# Altium schematic sheet [1] Shield.SchDoc
size A4; DocumentNumber: 2; SheetNumber: 2; SheetTotal: 5
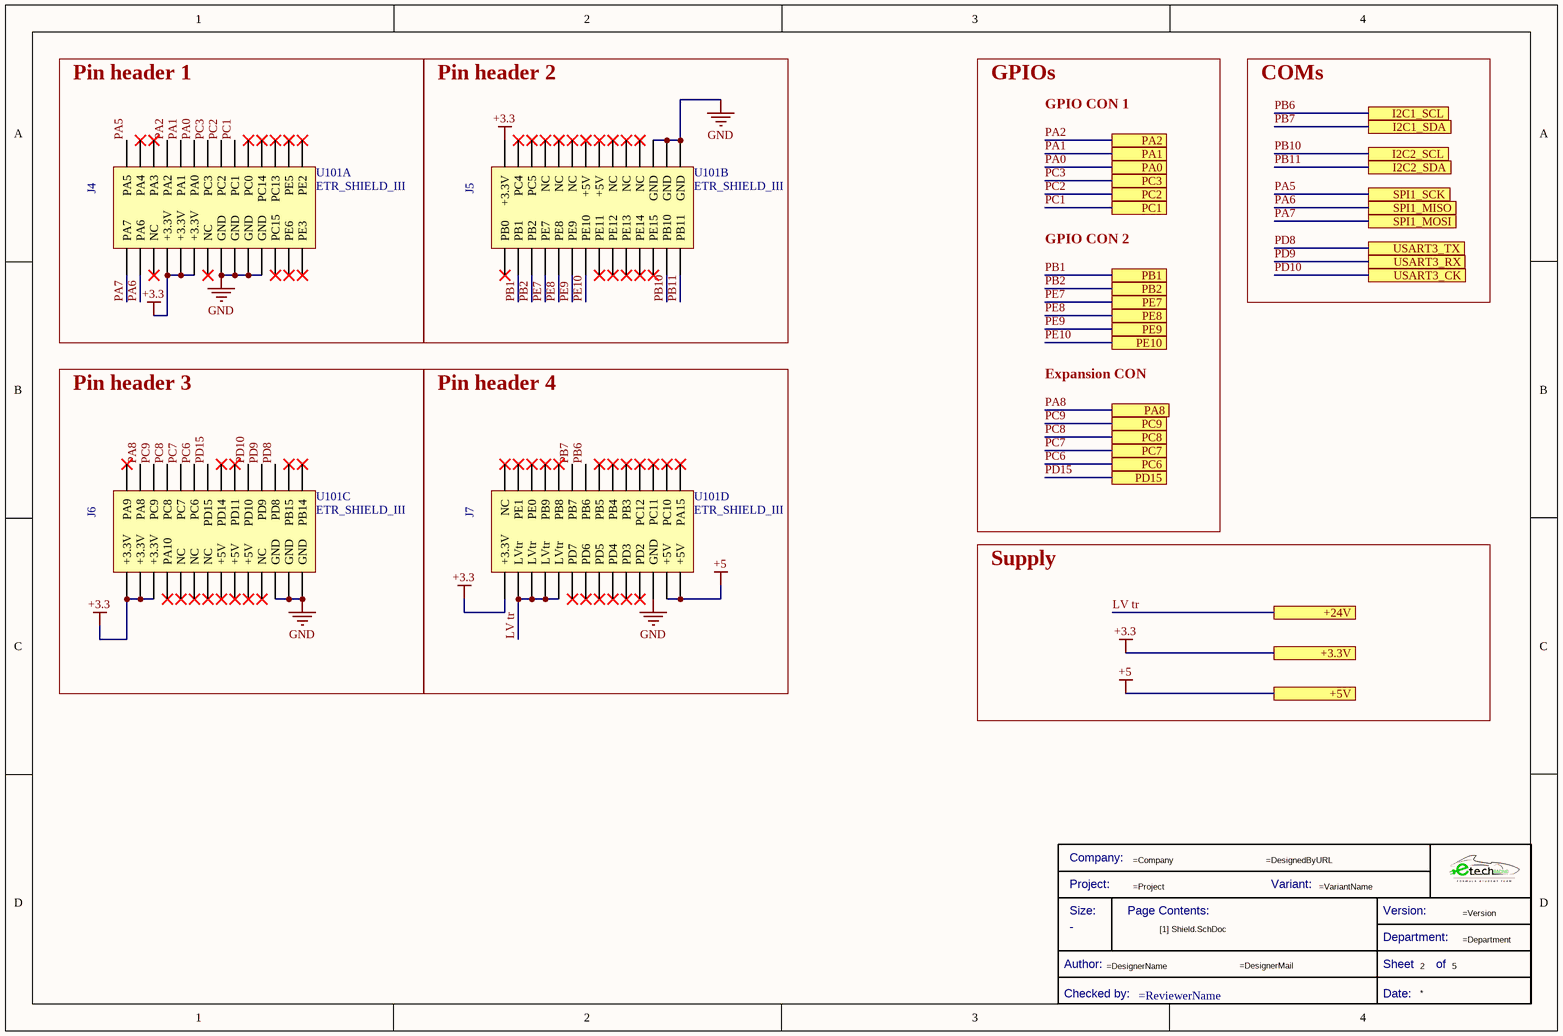
[diagram p0: [1] Shield.SchDoc]

## Parts
*  Title Block_template  (value not drawn)  (graphical)
U101  ETR_SHIELD_III  [ETR_SHIELD_III]  (parts A,B,C,D of 4)

## Blocks framed on the sheet
Pin header 1: U101
Pin header 2: U101
Pin header 3: U101
Pin header 4: U101

## Ports
+3.3V (see ETRX_FECU[2A]), +5V (see ETRX_FECU[2A]), +24V (see ETRX_FECU[2A]), I2C1_SCL (see ETRX_FECU[1A]), I2C1_SDA (see ETRX_FECU[1A]), I2C2_SCL (see ETRX_FECU[1A]), I2C2_SDA (see ETRX_FECU[1A]), PA0 (see ETRX_FECU[2A], [2] Sensors[1A]), PA1 (see ETRX_FECU[2A], [2] Sensors[1A]), PA2 (see ETRX_FECU[2A], [2] Sensors[1A]), PA8 (see ETRX_FECU[1B]), PB1 (see ETRX_FECU[2B], [2] Sensors[1A]), PB2 (see ETRX_FECU[2B], [2] Sensors[1A]), PC1 (see ETRX_FECU[2B], [2] Sensors[1A]), PC2 (see ETRX_FECU[2A], [2] Sensors[1A]), PC3 (see ETRX_FECU[2A], [2] Sensors[1A]), PC6 (see ETRX_FECU[1B]), PC7 (see ETRX_FECU[1B]), PC8 (see ETRX_FECU[1B]), PC9 (see ETRX_FECU[1B]), PD15 (see ETRX_FECU[1B]), PE7 (see ETRX_FECU[2B], [2] Sensors[1A]), PE8 (see ETRX_FECU[2B], [2] Sensors[1B]), PE9 (see ETRX_FECU[2B], [2] Sensors[1B]), PE10 (see ETRX_FECU[2B], [2] Sensors[1B]), SPI1_MISO (see ETRX_FECU[1B]), SPI1_MOSI (see ETRX_FECU[1B]), SPI1_SCK (see ETRX_FECU[1A]), USART3_CK (see ETRX_FECU[1B]), USART3_RX (see ETRX_FECU[1B]), USART3_TX (see ETRX_FECU[1B])

## Nets
+3.3: U101.3V3_1(+3.3V) U101.3V3_2(+3.3V) U101.3V3_3(+3.3V) U101.3V3_4(+3.3V) U101.3V3_5(+3.3V) U101.3V3_6(+3.3V) U101.3V3_7(+3.3V) U101.3V3_8(+3.3V) ; port +3.3V
+5: U101.5V_6(+5V) U101.5V_7(+5V) ; port +5V
GND: U101.GND_1(GND) U101.GND_2(GND) U101.GND_3(GND) U101.GND_4(GND) U101.GND_5(GND) U101.GND_6(GND) U101.GND_7(GND) U101.GND_8(GND) U101.GND_9(GND) U101.GND_10(GND) U101.GND_11(GND)
LV tr: U101.LVtr_1(LVtr) U101.LVtr_2(LVtr) U101.LVtr_3(LVtr) U101.LVtr_4(LVtr) ; port +24V
PA0: U101.PA0 ; port PA0
PA1: U101.PA1 ; port PA1
PA2: U101.PA2 ; port PA2
PA5: U101.PA5 ; port SPI1_SCK
PA6: U101.PA6 ; port SPI1_MISO
PA7: U101.PA7 ; port SPI1_MOSI
PA8: U101.PA8 ; port PA8
PB1: U101.PB1 ; port PB1
PB2: U101.PB2 ; port PB2
PB6: U101.PB6 ; port I2C1_SCL
PB7: U101.PB7 ; port I2C1_SDA
PB10: U101.PB10 ; port I2C2_SCL
PB11: U101.PB11 ; port I2C2_SDA
PC1: U101.PC1 ; port PC1
PC2: U101.PC2 ; port PC2
PC3: U101.PC3 ; port PC3
PC6: U101.PC6 ; port PC6
PC7: U101.PC7 ; port PC7
PC8: U101.PC8 ; port PC8
PC9: U101.PC9 ; port PC9
PD8: U101.PD8 ; port USART3_TX
PD9: U101.PD9 ; port USART3_RX
PD10: U101.PD10 ; port USART3_CK
PD15: U101.PD15 ; port PD15
PE7: U101.PE7 ; port PE7
PE8: U101.PE8 ; port PE8
PE9: U101.PE9 ; port PE9
PE10: U101.PE10 ; port PE10

Not connected (* = marked no-connect by the designer): U101 5V_1(+5V)* 5V_2(+5V)* 5V_3(+5V)* 5V_4(+5V)* 5V_5(+5V)* NC_1(NC)* NC_2(NC)* NC_3(NC)* NC_4(NC)* NC_5(NC)* NC_6(NC)* NC_7(NC)* NC_8(NC)* NC_9(NC)* NC_10(NC)* NC_11(NC)* NC_12(NC)* NC_13(NC)* PA3* PA4* PA9* PA10* PA15* PB0* PB3* PB4* PB5* PB8* PB9* PB14* PB15* PC0* PC4* PC5* PC10* PC11* PC12* PC13* PC14* PC15* PD2* PD3* PD4* PD5* PD6* PD7* PD11* PD14* PE0* PE1* PE2* PE3* PE5* PE6* PE11* PE12* PE13* PE14* PE15*

## Notes on the sheet
- GPIOs
- GPIO CON 1
- COMs
- GPIO CON 2
- Expansion CON
- Supply
- (in symbol ETR_Shield_III, part A) J4
- (in symbol ETR_Shield_III, part B) J5
- (in symbol ETR_Shield_III, part C) J6
- (in symbol ETR_Shield_III, part D) J7
- (in symbol Title Block_template) Company:; Project:; Variant:; Size:; Page Contents:; Version:; Department:; Author:; Sheet; of; Checked by:; Date:

## Library data of the parts
* = Title Block_template: Standard Title Block; .Creator: GP; Category: Title Block; .PCBcheck: GP; .SCHcheck: GP; Checked by:: =ReviewerName; Size: -